# Altium schematic sheet PDN.SchDoc
size 431 x 279 mm; Organization: ORGANIZATION; Address1: ADDRESS 1; Address2: ADDRESS 2; Address3: ADDRESS 3; Address4: ADDRESS 4; Revision: -; SheetNumber: 4; SheetTotal: 8; ENG_APP_DATE: --/--/--; DSN_APP_DATE: --/--/--; CHK_APP_DATE: --/--/--
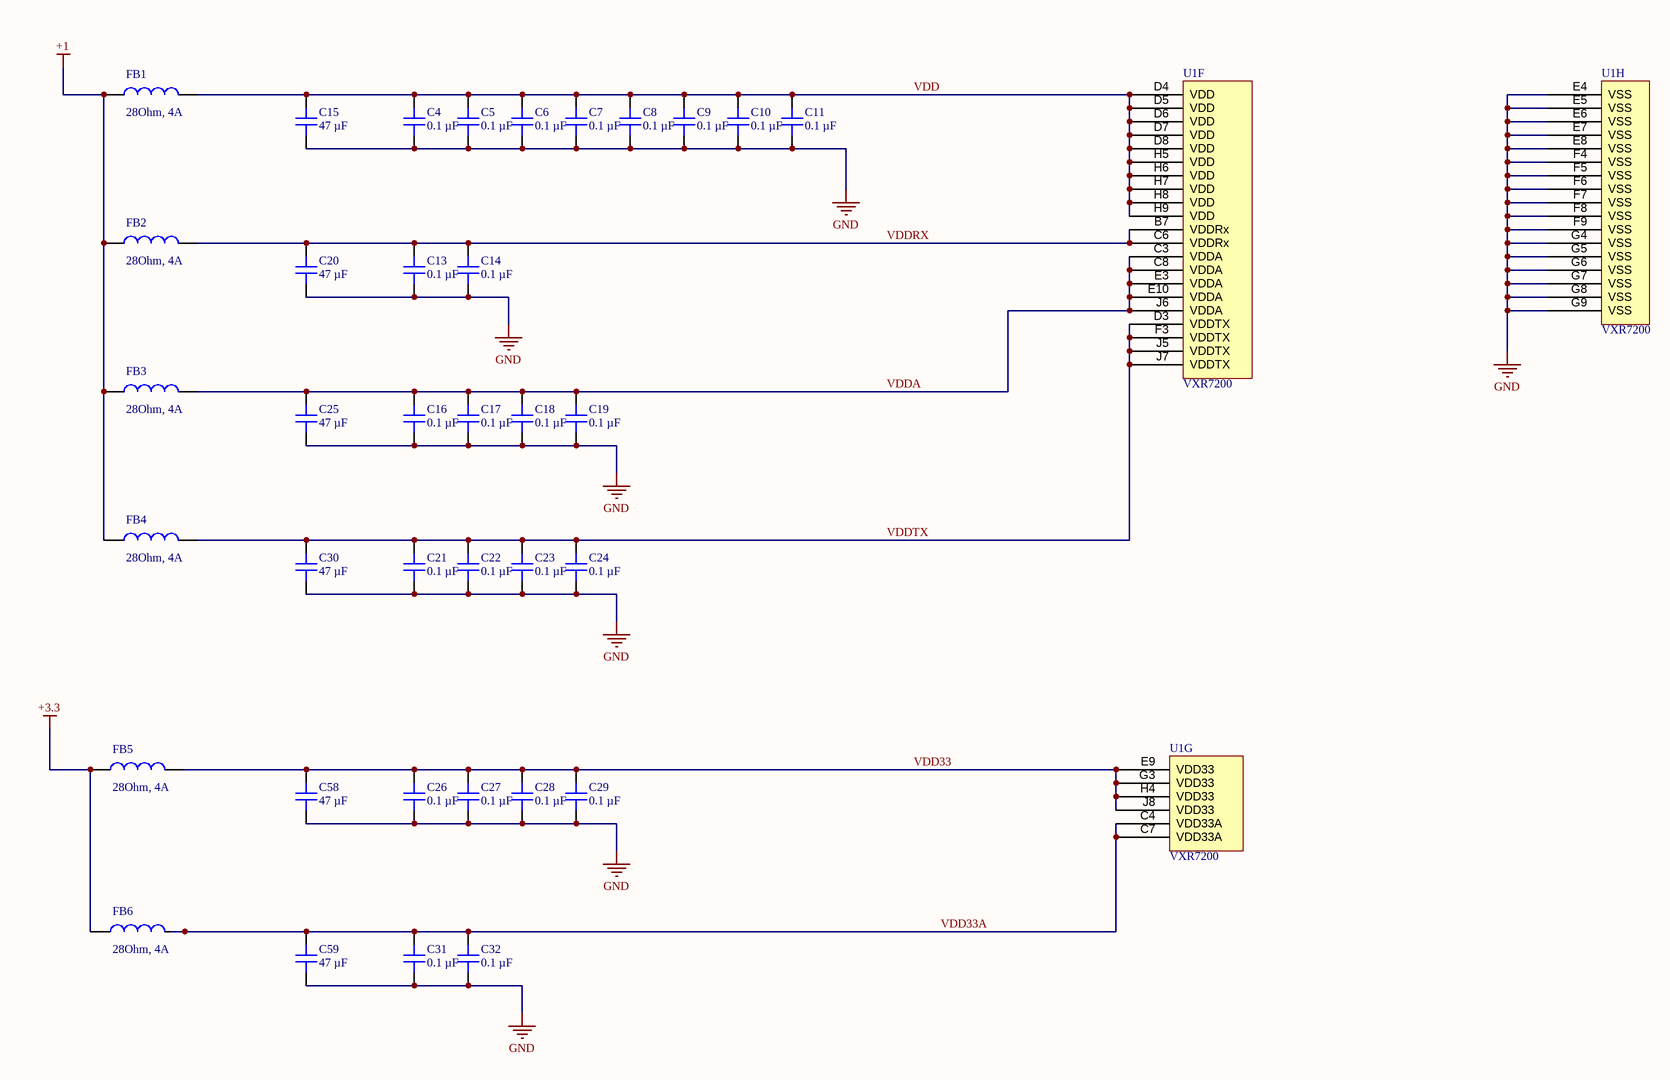
[diagram p0: PDN.SchDoc]

## Parts
C4  0.1 µF  [CAP 0201_0603]
C5  0.1 µF  [CAP 0201_0603]
C6  0.1 µF  [CAP 0201_0603]
C7  0.1 µF  [CAP 0201_0603]
C8  0.1 µF  [CAP 0201_0603]
C9  0.1 µF  [CAP 0201_0603]
C10  0.1 µF  [CAP 0201_0603]
C11  0.1 µF  [CAP 0201_0603]
C13  0.1 µF  [CAP 0201_0603]
C14  0.1 µF  [CAP 0201_0603]
C15  47 µF  [CAP 0603_1608]
C16  0.1 µF  [CAP 0201_0603]
C17  0.1 µF  [CAP 0201_0603]
C18  0.1 µF  [CAP 0201_0603]
C19  0.1 µF  [CAP 0201_0603]
C20  47 µF  [CAP 0603_1608]
C21  0.1 µF  [CAP 0201_0603]
C22  0.1 µF  [CAP 0201_0603]
C23  0.1 µF  [CAP 0201_0603]
C24  0.1 µF  [CAP 0201_0603]
C25  47 µF  [CAP 0603_1608]
C26  0.1 µF  [CAP 0201_0603]
C27  0.1 µF  [CAP 0201_0603]
C28  0.1 µF  [CAP 0201_0603]
C29  0.1 µF  [CAP 0201_0603]
C30  47 µF  [CAP 0603_1608]
C31  0.1 µF  [CAP 0201_0603]
C32  0.1 µF  [CAP 0201_0603]
C58  47 µF  [CAP 0603_1608]
C59  47 µF  [CAP 0603_1608]
FB1  28Ohm, 4A  [WE-CBF_0603_High Current]
FB2  28Ohm, 4A  [WE-CBF_0603_High Current]
FB3  28Ohm, 4A  [WE-CBF_0603_High Current]
FB4  28Ohm, 4A  [WE-CBF_0603_High Current]
FB5  28Ohm, 4A  [WE-CBF_0603_High Current]
FB6  28Ohm, 4A  [WE-CBF_0603_High Current]
U1  VXR7200  [BGA100P9X9-81A]  (parts F,G,H of 9)

## Nets
+1: FB1.1 FB2.1 FB3.1 FB4.1
+3.3: FB5.1 FB6.1
GND: C4.1 C5.1 C6.1 C7.1 C8.1 C9.1 C10.1 C11.1 C13.1 C14.1 C15.1 C16.1 C17.1 C18.1 C19.1 C20.1 C21.1 C22.1 C23.1 C24.1 C25.1 C26.1 C27.1 C28.1 C29.1 C30.1 C31.1 C32.1 C58.1 C59.1 U1.E4(VSS) U1.E5(VSS) U1.E6(VSS) U1.E7(VSS) U1.E8(VSS) U1.F4(VSS) U1.F5(VSS) U1.F6(VSS) U1.F7(VSS) U1.F8(VSS) U1.F9(VSS) U1.G4(VSS) U1.G5(VSS) U1.G6(VSS) U1.G7(VSS) U1.G8(VSS) U1.G9(VSS)
VDD: C4.2 C5.2 C6.2 C7.2 C8.2 C9.2 C10.2 C11.2 C15.2 FB1.2 U1.D4(VDD) U1.D5(VDD) U1.D6(VDD) U1.D7(VDD) U1.D8(VDD) U1.H5(VDD) U1.H6(VDD) U1.H7(VDD) U1.H8(VDD) U1.H9(VDD)
VDD33: C26.2 C27.2 C28.2 C29.2 C58.2 FB5.2 U1.E9(VDD33) U1.G3(VDD33) U1.H4(VDD33) U1.J8(VDD33)
VDD33A: C31.2 C32.2 C59.2 FB6.2 U1.C4(VDD33A) U1.C7(VDD33A)
VDDA: C16.2 C17.2 C18.2 C19.2 C25.2 FB3.2 U1.C3(VDDA) U1.C8(VDDA) U1.E3(VDDA) U1.E10(VDDA) U1.J6(VDDA)
VDDRX: C13.2 C14.2 C20.2 FB2.2 U1.B7(VDDRx) U1.C6(VDDRx)
VDDTX: C21.2 C22.2 C23.2 C24.2 C30.2 FB4.2 U1.D3(VDDTX) U1.F3(VDDTX) U1.J5(VDDTX) U1.J7(VDDTX)

## Notes on the sheet
- DWG. NO.
- REV.
- SHT.
- REVISION
- DESCRIPTION
- DATE
- APPROVED
- ENG:
- APPROVALS
- PROJECT
- DSN:
- CHK:
- REFERENCE DOCUMENTS
- PROJECT REVISION:
- TITLE
- SimulaVR
- DOCUMENT REVISION:
- DESIGN ITEM:
- BOM:
- FAB DWG:
- PCB DWG:
- ASSY DWG:
- SCALE:
- SIZE
- B
- CAGE CODE
- FILE NAME
- DWG NO.
- SHEET
- OF
- REV

## Library data of the parts
C4-C11 C13 C14 C16-C19 C21-C24 C26-C29 C31 C32 = GRM033R61E104KE14D: CAP CER 0.1UF 25V X5R 0201; manufacturer: Murata Electronics; Tolerance: ±10%; Part Number: GRM033R61E104KE14D; Value: 0.1 µF; Applications: General Purpose; Capacitance: 0.1 µF; componentlink1description: Datasheet; componentlink1url: https://search.murata.co.jp/Ceramy/image/img/A01X/G101/ENG/GRM033R61E104KE14-01.pdf; componentlink2description: DigiKey Link; componentlink2url: https://www.digikey.com/en/products/detail/murata-electronics/GRM033R61E104KE14D/4904731; Device Package: 0201 (0603 Metric); lastupdated: 5/20/2022 2:33:00 PM; Lifecycle Status: Active; Minimum Order: 1; Mounting Type: Surface Mount; Operating Temperature: -55°C ~ 85°C; Package / Case: 0201 (0603 Metric); packaging: TapeAndReel; Part Status: Active; price: 0.01; series: GRM; Size / Dimension: 0.024" L x 0.012" W (0.60mm x 0.30mm); Supplier 1: DigiKey; Supplier Part Number 1: 490-12686-1-ND; Temperature Coefficient: X5R; Thickness (Max): 0.013" (0.33mm); Voltage - Rated: 25V; partid: 39731
C15 C20 C25 C30 C58 C59 = GRM188R60J476ME01D: CAP CER 47UF 6.3V X5R 0603; manufacturer: Murata Electronics; Tolerance: ±20%; Part Number: GRM188R60J476ME01D; Value: 47 µF; Applications: General Purpose; Capacitance: 47 µF; componentlink2description: DigiKey Link; componentlink2url: https://www.digikey.com/en/products/detail/murata-electronics/GRM188R60J476ME01D/13996874; Device Package: 0603 (1608 Metric); lastupdated: 5/20/2022 2:38:45 PM; Lifecycle Status: Active; Minimum Order: 1; Mounting Type: Surface Mount, MLCC; Operating Temperature: -55°C ~ 85°C; Package / Case: 0603 (1608 Metric); packaging: TapeAndReel; partid: 44498; Part Status: Active; price: 0.10; series: GRM; Size / Dimension: 0.063" L x 0.031" W (1.60mm x 0.80mm); Supplier 1: DigiKey; Supplier Part Number 1: 490-GRM188R60J476ME01DCT-ND; Temperature Coefficient: X5R; Thickness (Max): 0.039" (1.00mm); Voltage - Rated: 6.3V
FB1-FB6 = 742792603: WE-CBF SMT EMI Suppression Ferrite Bead, size 0603, 28Ohm, 4A; Manufacturer: Wurth Elektronik; Case/Size Code: 0603; Impedance Max: 45Ohm; Impedance Max Test Condition: 1000MHz; DC Resistance Max: 0.03Ohm; Type: High Current; Width: 0.8mm; Packaging: Tape and Reel; Height: 0.8mm; Length: 1.6mm; ComponentLink1Description: Manufacturer Link; ComponentLink1URL: http://www.we-online.de; ComponentLink2Description: Datasheet; ComponentLink2URL: https://www.we-online.com/catalog/datasheet/742792603.pdf; Manufacturer Part Number: 742792603; Mount: SMT; Operating Temperature Max: 125°C; Operating Temperature Min: -55°C; Category: Ferrites for PCB Assembly; Match Code: WE-CBF; Impedance @100MHz: 28Ohm; Rated Current: 4A
U1 = CMP-015-00008-4: VXR7200 DP to MIPI-DSI bridge